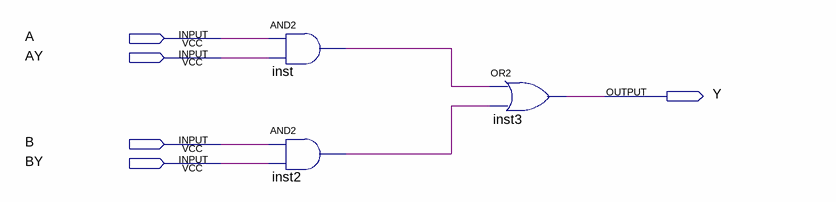
[diagram p0: schematic sheet]
// Quartus schematic select2-1.bdf as structural Verilog: 3 symbols, 5 pins
module \select2-1  (
  input  A,
  input  AY,
  input  B,
  input  BY,
  output Y
);

  wire inst2_out, inst_out;

  and inst (inst_out, A, AY);
  and inst2 (inst2_out, B, BY);
  or inst3 (Y, inst_out, inst2_out);
endmodule
